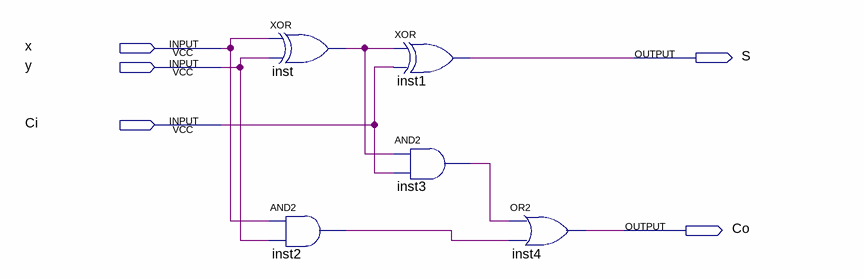
[diagram p0: schematic sheet]
// Quartus schematic fulladder1.bdf as structural Verilog: 5 symbols, 5 pins
module fulladder1 (
  input  x,
  input  y,
  input  Ci,
  output S,
  output Co
);

  wire inst2_out, inst3_out, inst_out;

  xor inst (inst_out, x, y);
  and inst2 (inst2_out, x, y);
  xor inst1 (S, inst_out, Ci);
  and inst3 (inst3_out, inst_out, Ci);
  or inst4 (Co, inst3_out, inst2_out);
endmodule
